# EasyEDA Pro project ProProject_迷你自平衡三棱柱2_2023-12-08.epro

# Schematic schematic1
Create Date: 2023-11-03; Page Name: P1; Project Name: 迷你自平衡三棱柱2; Schematic Name: schematic1; Update Date: 2023-11-15; Company: 嘉立创EDA; Page Size: A4; Version: V1.0
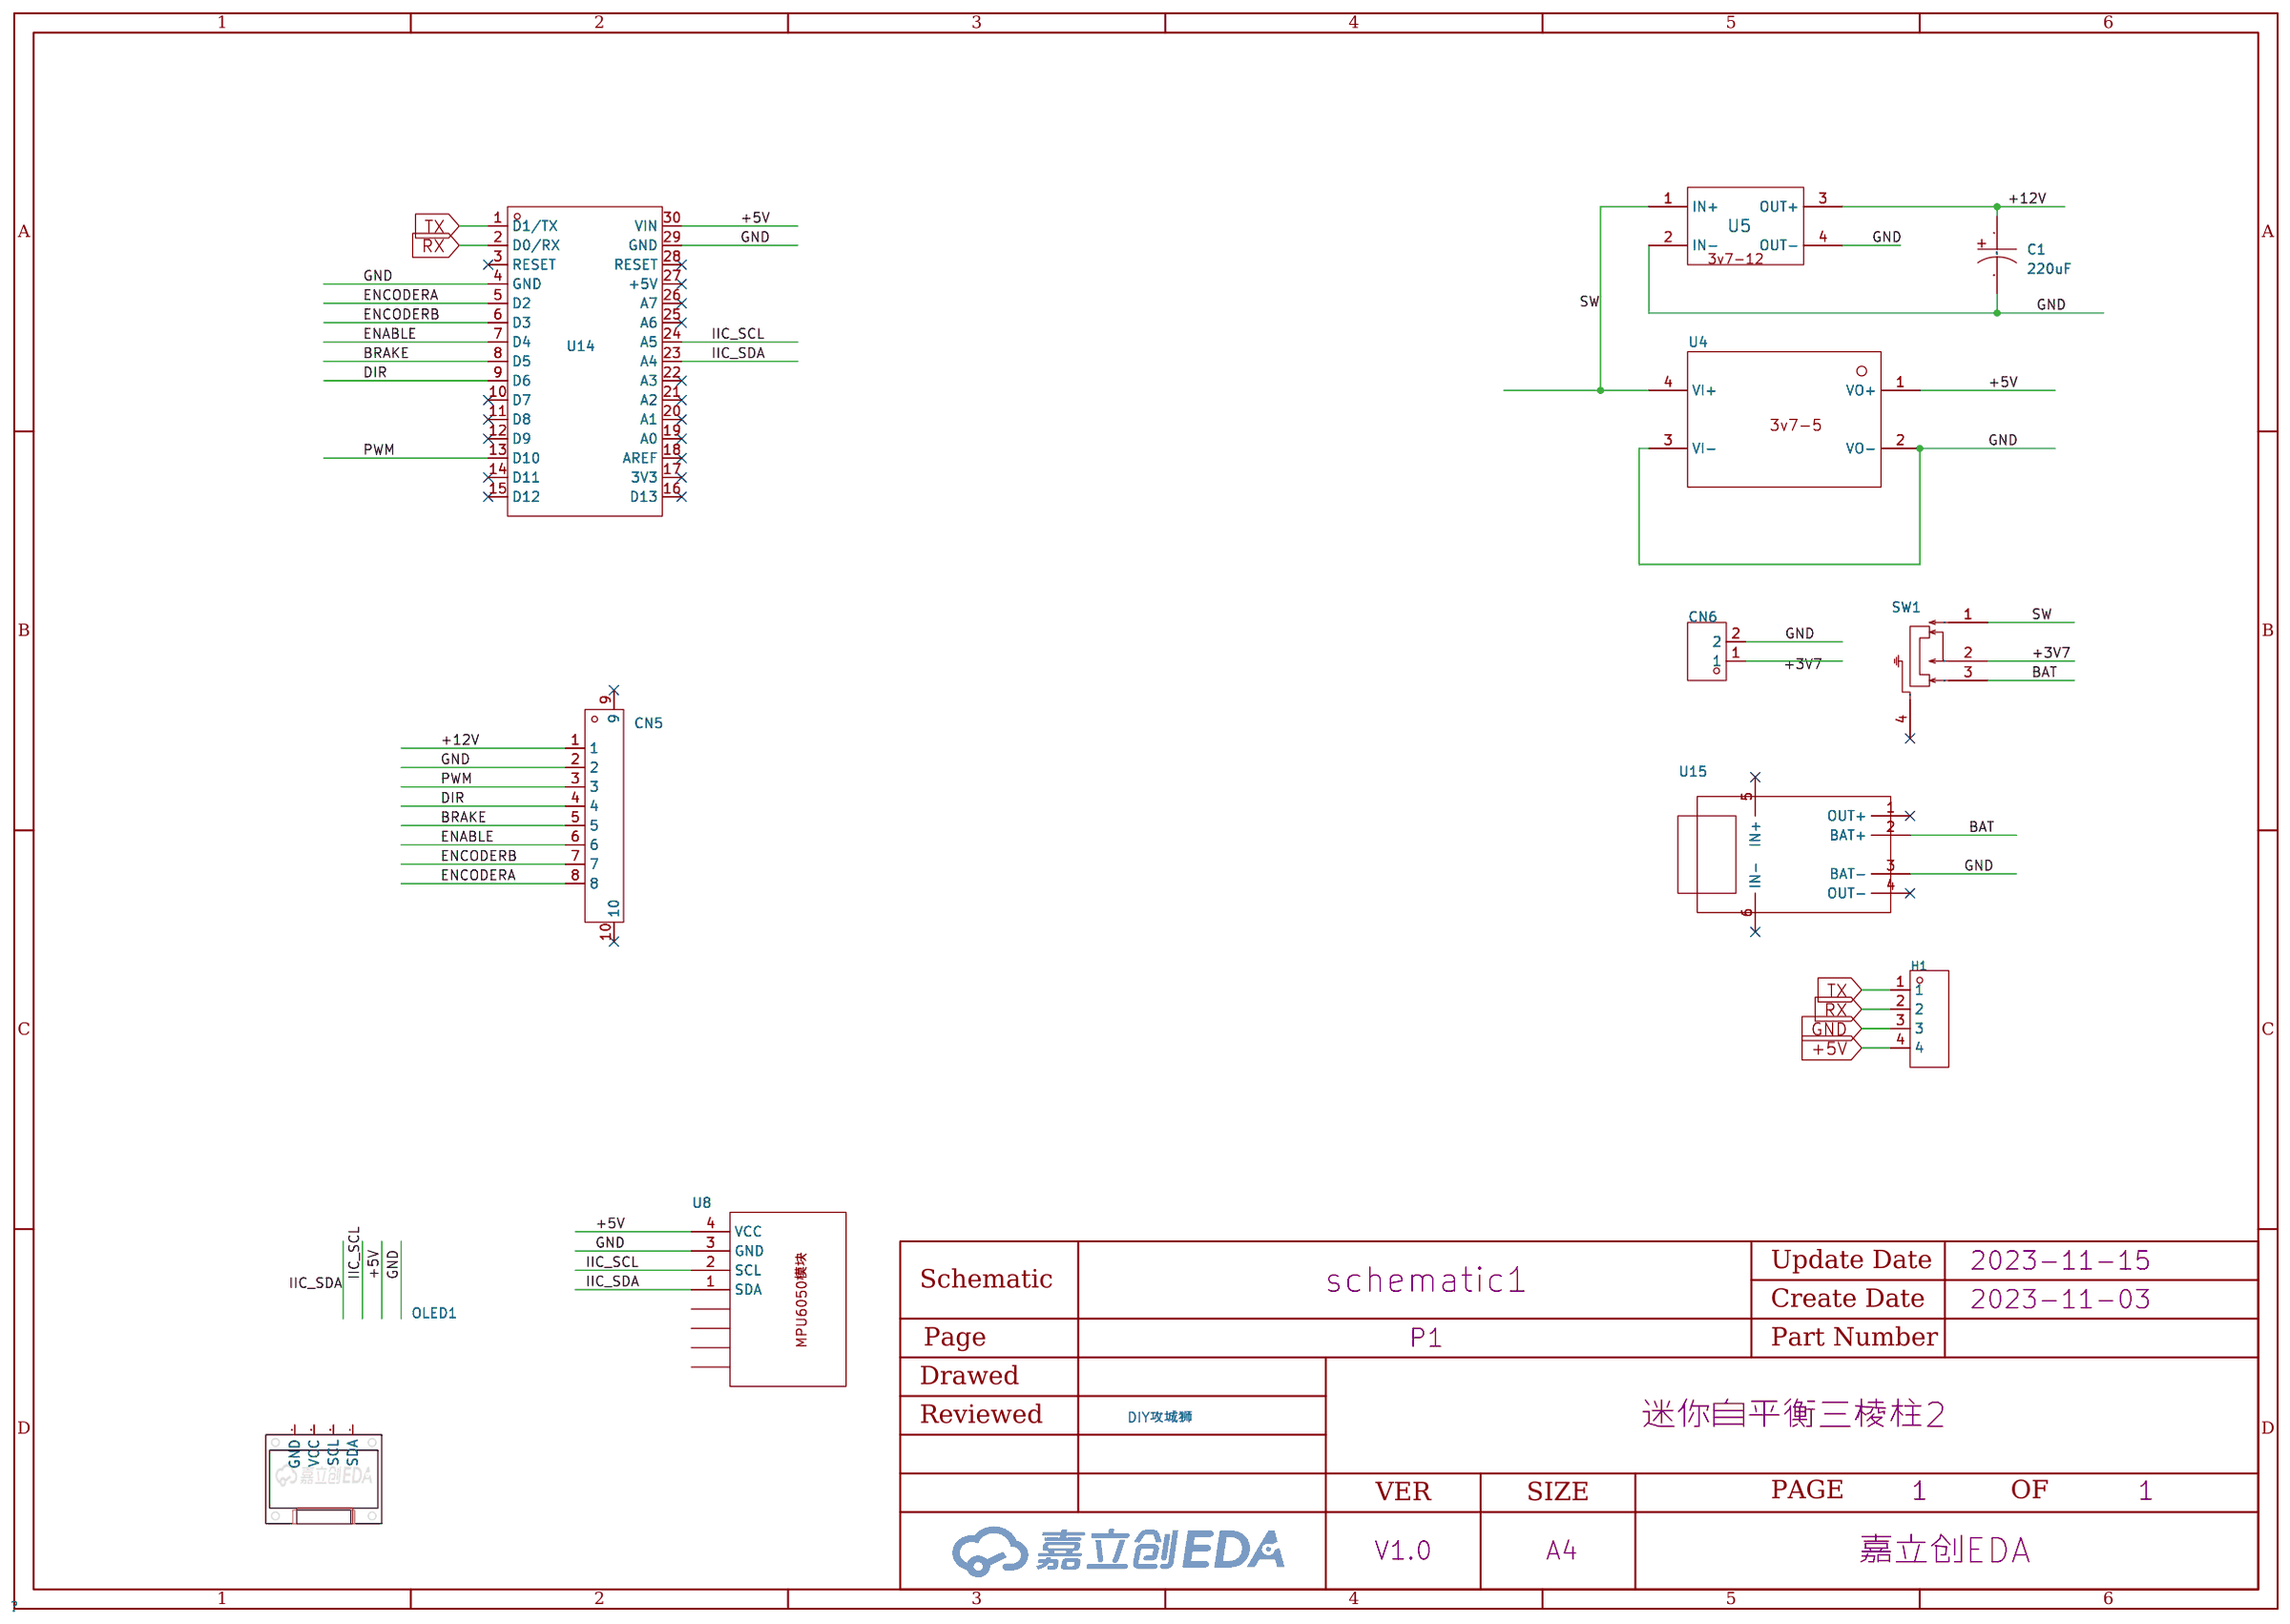
[diagram p0: schematic sheet]

## Parts
C1  220uF  [CAP-SMD_BD8.0-L8.3-W8.3-FD]
CN5  GH1.25-8PLTPZ  [CONN-SMD_GH1.25-8PLTPZ]
CN6  B2B-XH-A(LF)(SN)  [CONN-TH_B2B-XH-A-LF-SN]
H1  -  [HDR-TH_4P-P2.54-V-M]
OLED1  -  [0.96OLED_4P]
SW1  HX MSK12CO2-BBTM  [SW-SMD_MSK12C02-HB]
U4  DM13-05  [DM13-05]
U5  -  [DC3V7-DC12]
U8  -  [MPU-6050模块2]
U14  ARDUINO_NANO  [COMM-TH_ARDUINO_NANO2]
U15  -  [TP4057模块封装]

## Library data of the parts
C1 = EEEFP1V221AP: 容值:220uF;精度:±20%;额定电压:35V;电容体直径:8mm;电容体长度:10.2mm;纹波电流:-;等效串联电阻:-;工作寿命:2000hrs@105℃;工作温度:-45℃~+105℃;; LCSC Part Name: 220uF ±20% 35V; Supplier Part: C278406; Manufacturer: PANASONIC(松下); Supplier Footprint: SMD,8x10.2mm; JLCPCB Part Class: Extended Part; Datasheet: https://atta.szlcsc.com/upload/public/pdf/source/20181130/C278406_CB9CD87BC4579E70B6A89BF3334E5E7E.pdf; Supplier: LCSC; Tolerance: ±20%; Rated Voltage: 35V; φD: 8mm; L: 10.2mm; Lifetime @ Temp: 2000hrs@105℃; Operating Temperature: -45℃~+105℃
CN5 = GH1.25-8PLTPZ: LCSC Part Name: GH1.25-8P立贴编带加盖; Supplier Part: C2829266; Manufacturer: BOOMELE(博穆精密); JLCPCB Part Class: Extended Part; Datasheet: https://atta.szlcsc.com/upload/public/pdf/source/20211125/08A09A4909F58AF780B71FE423A00F7E.pdf; Supplier: LCSC
CN6 = B2B-XH-A(LF)(SN): 参考系列:XH;间距:2.5mm;插针结构:1x2P;排数:1;每排PIN数:2;行距:-;安装方式:-;触头材质:黄铜;; LCSC Part Name: XH 2.5mm 1x2P; Supplier Part: C158012; Manufacturer: JST; Supplier Footprint: 插件,P=2.5mm; JLCPCB Part Class: Extended Part; Datasheet: https://atta.szlcsc.comnull; Supplier: LCSC; Reference Series: XH; Pitch: 2.5mm; Pins Structure: 1x2P; Number of Rows: 1; Number of PINs Per Row: 2; Contact Material: 黄铜
H1 = HDR-M_2.54_1x4P: Supplier Part: C492403; Supplier Footprint: 插件
OLED1 = 0.96OLED模块_4P: Supplier Footprint: 插件
SW1 = HX MSK12CO2-BBTM: LCSC Part Name: 拨动开关 MSK12C02两档侧拨贴片 7脚拨动 白柄带膜,柄长1.5mm,耐温; Supplier Part: C5149818; Manufacturer: hanxia(韩下); Supplier Footprint: SMD; JLCPCB Part Class: 扩展库; Datasheet: https://atta.szlcsc.com/upload/public/pdf/source/20220909/02E3C8DB095F8D03A7BE1249731DCC0B.pdf; Supplier: LCSC
U4 = DM13-05: _: 3
U5 = DC3V7-DC12
U8 = MPU-6050模块
U14 = ARDUINO_NANO: Supplier Part: C9900017879; Supplier Footprint: 插件; JLCPCB Part Class: 扩展库; Datasheet: https://atta.szlcsc.comnull; Supplier: LCSC
U15 = TP4057模块

## Nets
+3V7: CN6.1 SW1.2
+5V: H1.4 U4.1(VO+) U8.4(VCC) U14.30(VIN)
+12V: C1.1 CN5.1 U5.3(OUT+)
GND: C1.2 CN5.2 CN6.2 H1.3 U4.2(VO-) U4.3(VI-) U5.2(IN-) U5.4(OUT-) U8.3(GND) U14.4(GND) U14.29(GND) U15.3(BAT-)
BAT: SW1.3 U15.2(BAT+)
BRAKE: CN5.5 U14.8(D5)
DIR: CN5.4 U14.9(D6)
ENABLE: CN5.6 U14.7(D4)
ENCODERA: CN5.8 U14.5(D2)
ENCODERB: CN5.7 U14.6(D3)
IIC_SCL: U8.2(SCL) U14.24(A5)
IIC_SDA: U8.1(SDA) U14.23(A4)
PWM: CN5.3 U14.13(D10)
RX: H1.2 U14.2(D0/RX)
SW: SW1.1 U4.4(VI+) U5.1(IN+)
TX: H1.1 U14.1(D1/TX)

Not connected (* = marked no-connect by the designer): CN5 9* 10*; OLED1 1(GND) 2(VCC) 3(SCL) 4(SDA); SW1 4*; U14 3(RESET)* 10(D7)* 11(D8)* 12(D9)* 14(D11)* 15(D12)* 16(D13)* 17(3V3)* 18(AREF)* 19(A0)* 20(A1)* 21(A2)* 22(A3)* 25(A6)* 26(A7)* 27(+5V)* 28(RESET)*; U15 1(OUT+)* 4(OUT-)* 5(IN+)* 6(IN-)*

## Notes on the sheet
- DIY攻城狮

# Board PCB1_1
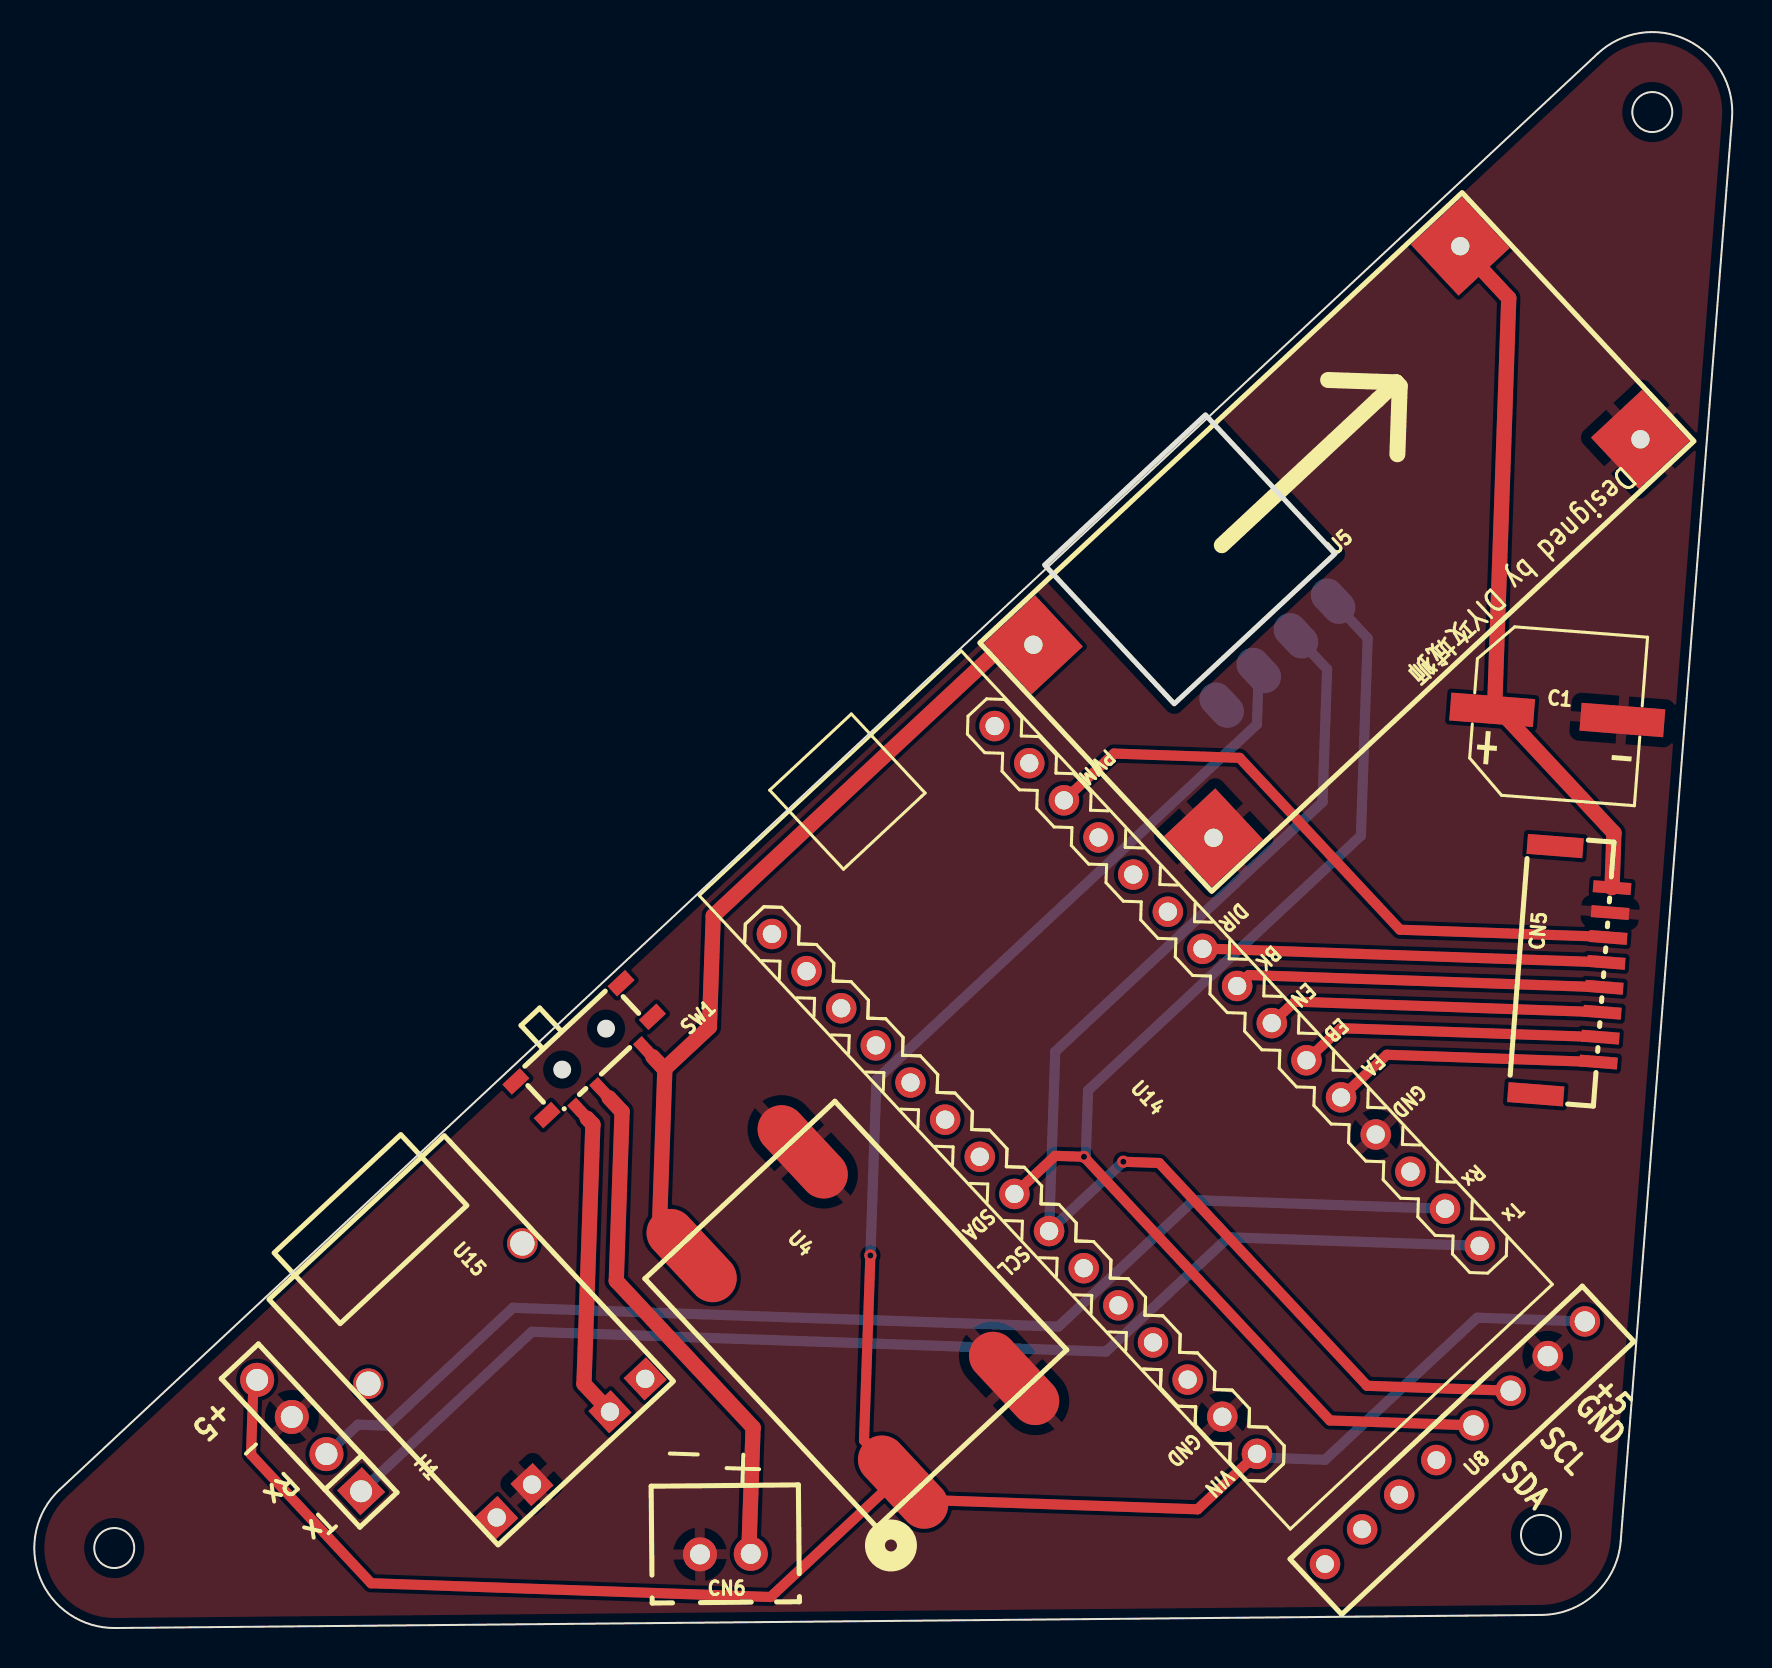
[diagram p1: board, top side]
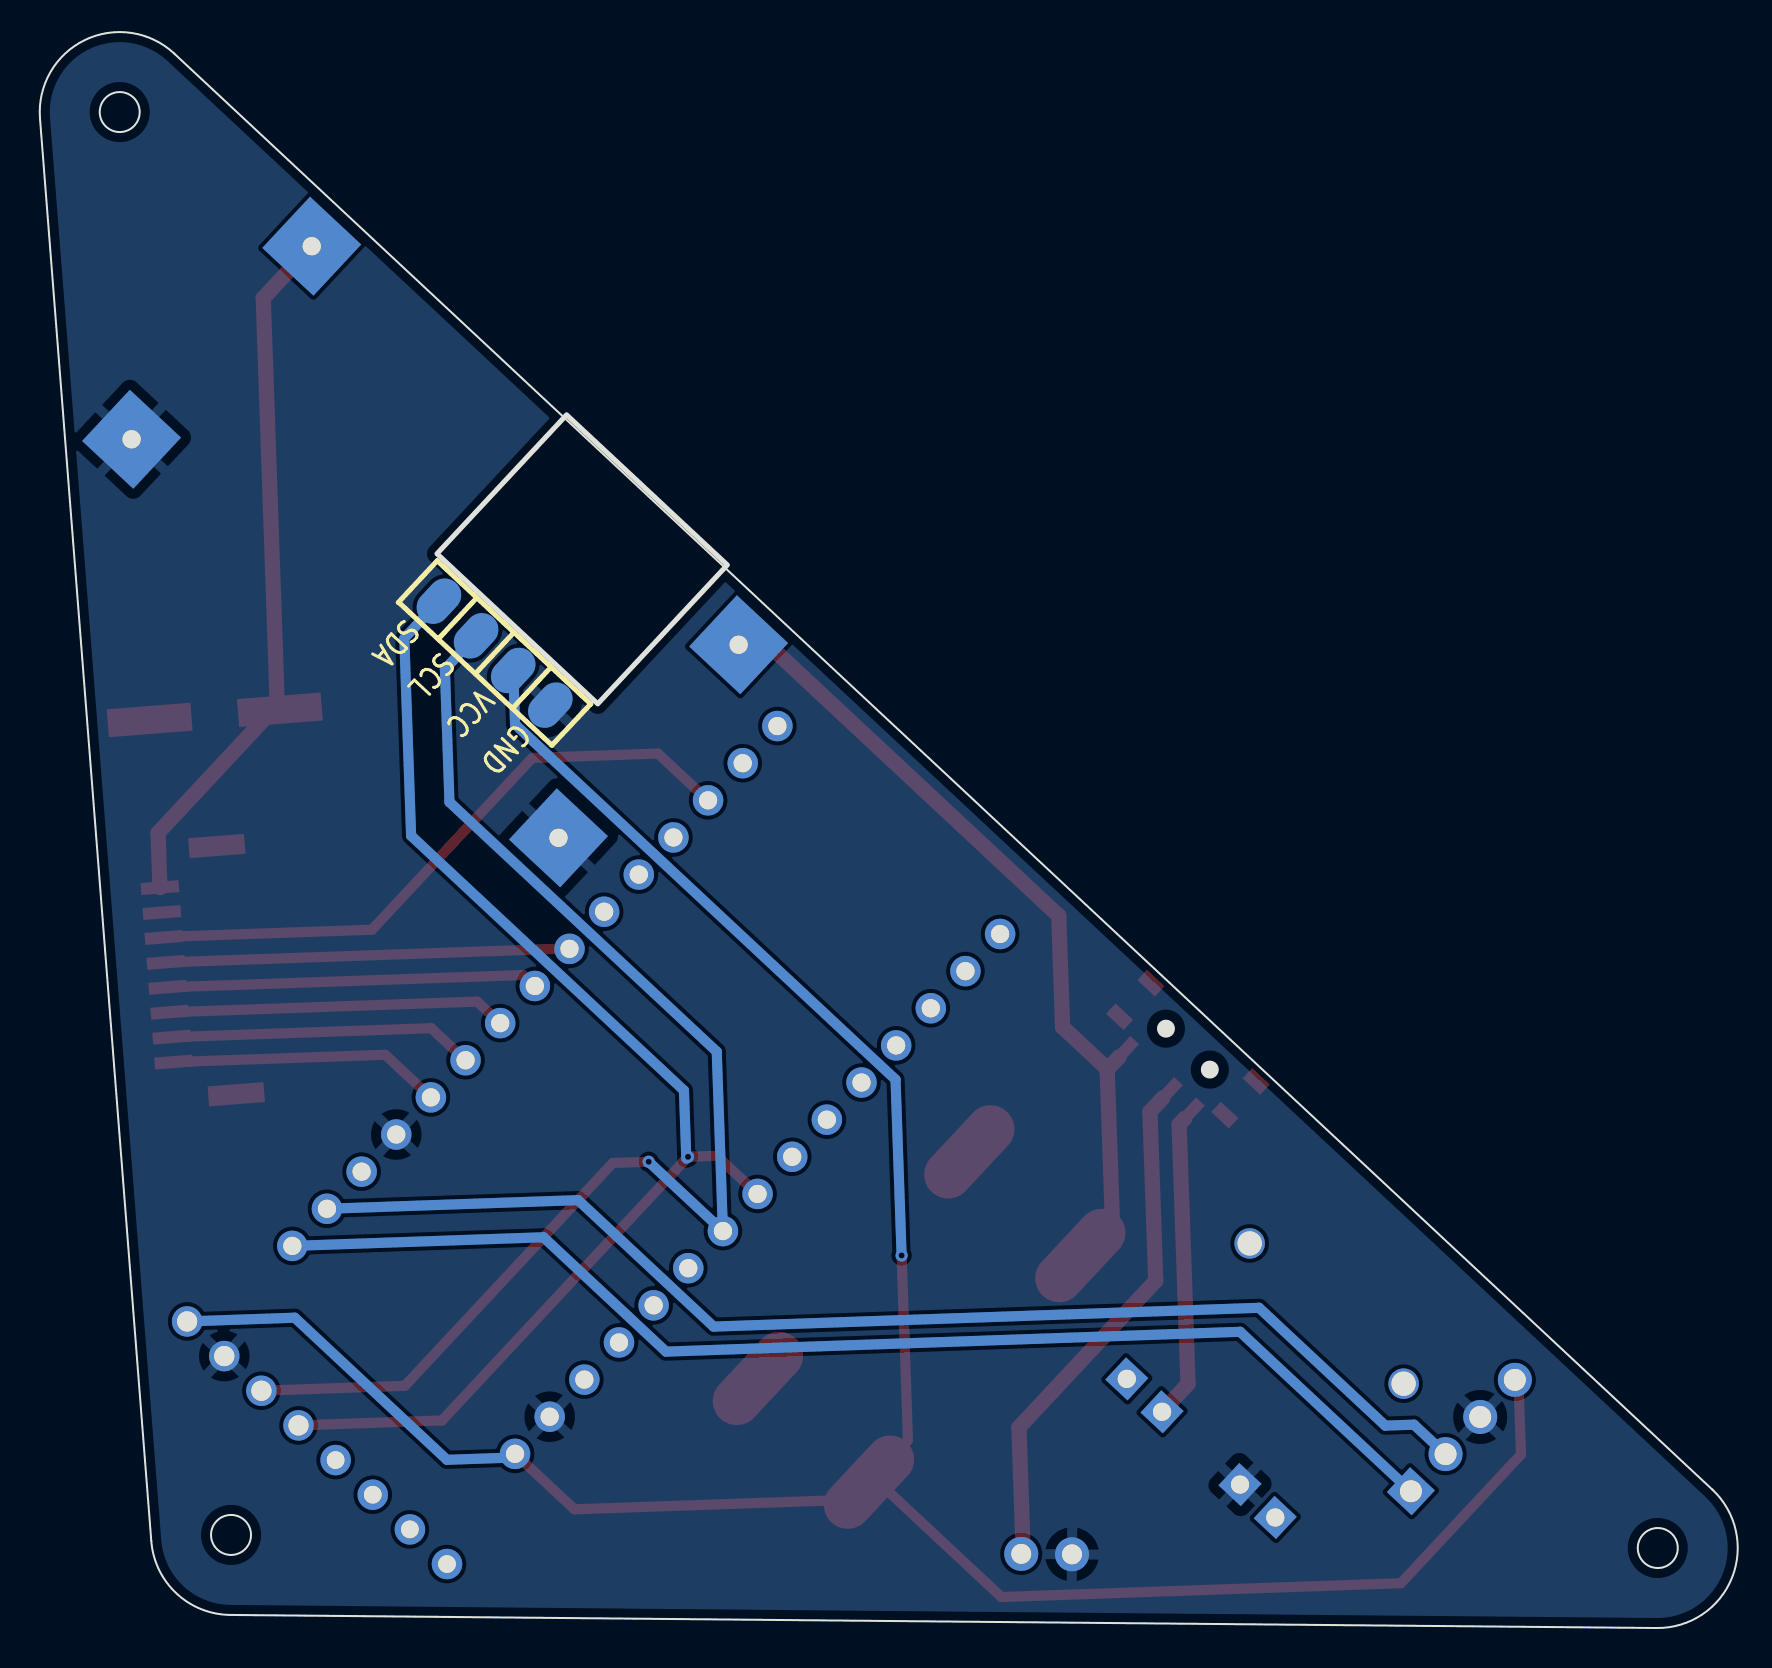
[diagram p2: board, bottom side, seen from below]

Outline 84.64 x 79.41 mm; copper layers: Top Layer, Bottom Layer. Coordinates in mm from the lower left corner of the outline.
Outline path: circle c3.71,4 r1 ; 64.78,53.72 56.74,46.22 50.26,53.16 58.3,60.67 closed ; circle c75.08,4.65 r1 ; circle c80.65,75.81 r1 ; 0.99,6.92 77.92,78.73 arc(82.39,79.41) 84.64,75.5 79.07,4.34 arc(77.81,1.73) 75.12,0.65 3.75,0 arc(0,2.52) 0.99,6.92
Stack: Top Layer 0.035mm / Dielectric1 1.51mm FR4 er 4.5 / Bottom Layer 0.035mm

## Design rules (mm)
template: 自定义配置
spacing copperThickness1oz (default): track to track 0.102, other pairs 0.152 to 0.3
spacing copperThickness2oz: track to track 0.203, other pairs 0.152 to 0.3
track width copperThickness1oz (default): min 0.127, default 0.254, max 2.54
track width copperThickness2oz: min 0.203, default 0.254, max 2.54
differential pair differentialPair (default): width min 0.127, default 0.254, max 2.54; gap min 0.152, default 0.152
via viaSize (default): diameter min 0.5, default 0.61, max 10; hole min 0.3, default 0.305, max 6.3

## Placement (name value [footprint] x y rotation side)
C1  220uF  [CAP-SMD_BD8.0-L8.3-W8.3-FD]  75.9 45.66 355.5 top
CN5  GH1.25-8PLTPZ  [CONN-SMD_GH1.25-8PLTPZ]  76.8 32.78 265.5 top
CN6  B2B-XH-A(LF)(SN)  [CONN-TH_B2B-XH-A-LF-SN]  34.29 3.7 0.5 top
H1  -  [HDR-TH_4P-P2.54-V-M]  13.46 9.62 133 top
OLED1  -  [0.96oled_4p]  61.9 48.75 223 bottom
SW1  HX MSK12CO2-BBTM  [SW-SMD_MSK12C02-HB]  27.59 28.55 223 top
U4  -  [DM13-05]  40.81 15.69 133 top
U5  -  [dc3v7-dc12]  64.87 54.31 43 top
U8  -  [MPU-6050模块2]  70.69 9.36 43 top
U14  ARDUINO_NANO  [comm-th_arduino_nano2]  54.31 26.91 313 top
U15  -  [TP4057模块封装]  21.53 14.38 313 top

## Footprints (pads in the part's own frame, mm; a bottom-side part is the same pattern mirrored in y, then rotated)
0.96oled_4p
  oval 1.65x2.5 smd: 1(-3.81,-0.002) 2(-1.27,0.002) 3(1.27,0.002) 4(3.81,0.002)
CAP-SMD_BD8.0-L8.3-W8.3-FD
  rect 4.2x1.4 smd: 1(-3.267,0) 2(3.267,0)
comm-th_arduino_nano2
  round 1.524 hole 0.914: 1(17.78,7.62) 2(15.24,7.62) 3(12.7,7.62) 4(10.16,7.62) 5(7.62,7.62) 6(5.08,7.62) 7(2.54,7.62) 8(0,7.62) 9(-2.54,7.62) 10(-5.08,7.62) 11(-7.62,7.62) 12(-10.16,7.62) 13(-12.7,7.62) 14(-15.24,7.62) 15(-17.78,7.62) 16(-17.78,-7.62) 17(-15.24,-7.62) 18(-12.7,-7.62) 19(-10.16,-7.62) 20(-7.62,-7.62) 21(-5.08,-7.62) 22(-2.54,-7.62) 23(0,-7.62) 24(2.54,-7.62) 25(5.08,-7.62) 26(7.62,-7.62) 27(10.16,-7.62) 28(12.7,-7.62) 29(15.24,-7.62) 30(17.78,-7.62)
CONN-SMD_GH1.25-8PLTPZ
  rect 0.6x1.9 smd: 1(-4.375,1.5) 2(-3.125,1.5) 3(-1.875,1.5) 4(-0.625,1.5) 5(0.625,1.5) 6(1.875,1.5) 7(3.125,1.5) 8(4.375,1.5)
  rect 1x2.8 smd: 9(6.225,-1.5) 10(-6.225,-1.5)
CONN-TH_B2B-XH-A-LF-SN
  round 1.7 hole 1: 1(1.27,0) 2(-1.27,0)
dc3v7-dc12
  rect 3.5x3.5 hole 0.914: 1(-14.605,6.604) 2(-14.605,-6.604) 3(14.605,6.604) 4(14.605,-6.604)
DM13-05
  oval 5.499x2.401 smd: 1(-7.75,4) 2(-7.75,-3.599) 3(7.75,-3.599) 4(7.75,4)
HDR-TH_4P-P2.54-V-M
  rect 1.7x1.7 hole 1.1: 1(-3.81,0)
  round 1.7 hole 1.1: 2(-1.27,0) 3(1.27,0) 4(3.81,0)
MPU-6050模块2
  round 1.524 hole 1.016x0.889: 1(1.27,-0.127) 2(3.81,-0.127) 3(6.35,-0.127) 4(8.89,-0.127)
  round 1.524 hole 0.889: 5(-8.89,-0.127) 6(-6.35,-0.127) 7(-3.81,-0.127) 8(-1.27,-0.127)
SW-SMD_MSK12C02-HB
  rect 0.6x1.524 smd: 1(-2.25,1.7) 2(0.75,1.7) 3(2.25,1.7)
  rect 1.2x0.7 smd: 4(-3.6,-1.7) 4(-3.6,0.6) 4(3.6,0.6) 4(3.6,-1.7)
TP4057模块封装
  rect 1.524x1.524 hole 0.914: 1(7.366,5.08) 2(7.366,2.667) 3(7.366,-2.667) 4(7.366,-5.08)
  round 1.524 hole 1.219: 5(-1.778,5.207) 6(-1.905,-5.207)

## Nets
+3V7: CN6.1 SW1.2
+5V: H1.4 OLED1.3 U4.1 U8.4 U14.30
+12V: C1.1 CN5.1 U5.3
GND: C1.2 CN5.2 CN6.2 H1.3 OLED1.4 U4.2 U4.3 U5.2 U5.4 U8.3 U14.4 U14.29 U15.3
BAT: SW1.3 U15.2
BRAKE: CN5.5 U14.8
DIR: CN5.4 U14.9
ENABLE: CN5.6 U14.7
ENCODERA: CN5.8 U14.5
ENCODERB: CN5.7 U14.6
IIC_SCL: OLED1.2 U8.2 U14.24
IIC_SDA: OLED1.1 U8.1 U14.23
PWM: CN5.3 U14.13
RX: H1.2 U14.2
SW: SW1.1 U4.4 U5.1
TX: H1.1 U14.1

Pads without a net: CN5 9 10; SW1 4; U8 5 6 7 8; U14 3 10 11 12 14 15 16 17 18 19 20 21 22 25 26 27 28; U15 1 4 5 6

## Via types
v1: diameter 0.61, hole 0.305, Top Layer to Bottom Layer, 3 vias

## Routing (per net, layer and track width the routed paths; a pad name or vN(x,y) marks a point on that pad's centre or on a via; arc(x,y) is an arc through that point)
+3V7: length 25.8
  Top Layer w0.762: 28.47,26.51 29.12,25.81 28.83,17.36 35.67,10.03 35.46,3.81 CN6.1
+5V: length 129
  Top Layer w0.508: 10.7,12.78 10.56,8.68 16.56,2.24 36.55,1.55 42.86,7.44 ; U14.30 57.9,5.94 43.99,6.42 U4.1 41.22,9.39 v1(41.54,18.63)
  Bottom Layer w0.508: 77.28,15.33 71.89,15.52 64.28,8.41 61.42,8.51 ; OLED1.3 60.87,45.19 41.84,27.43 v1(41.54,18.63)
+12V: length 35.4
  Top Layer w0.762: U5.3 73.47,66.5 72.77,46.15 78.73,39.76 CN5.1
BAT: length 15.3
  Top Layer w0.762: U15.2 27.21,12.21 27.66,25.18 27.37,25.49
BRAKE: length 18.6
  Top Layer w0.508: CN5.5 60.47,32.65 59.89,32.11
DIR: length 20.3
  Top Layer w0.508: 58.12,33.93 58.17,33.98 CN5.4
ENABLE: length 17
  Top Layer w0.508: 61.62,30.25 62.77,31.32 78.15,30.79
ENCODERA: length 13.7
  Top Layer w0.508: U14.5 67.37,28.67 CN5.8
ENCODERB: length 15.3
  Top Layer w0.508: 78.05,29.55 65.07,30 U14.6
IIC_SCL: length 65.5
  Top Layer w0.508: U8.2 66.38,12.11 55.99,23.25 v1(54.19,23.32)
  Bottom Layer w0.508: OLED1.2 64.39,47.94 64.16,41.3 50.79,28.82 U14.24 v1(54.19,23.32)
IIC_SDA: length 63.9
  Top Layer w0.508: U14.23 50.79,23.61 v1(52.22,23.56) 64.53,10.38 U8.1
  Bottom Layer w0.508: 52.31,23.47 52.43,26.88 66.08,39.62 66.42,49.49 OLED1.1
PWM: length 31.9
  Top Layer w0.508: U14.13 53.73,43.73 60.01,43.51 68.03,34.92 78.42,34.56 CN5.3
RX: length 61.4
  Bottom Layer w0.508: U14.2 57.72,21.4 50.94,15.07 23.66,16.01 17.34,10.12 15.91,10.17 H1.2
SW: length 40.8
  Top Layer w0.762: 30.66,28.56 31.26,27.92 31,20.34 32.6,18.63 ; 31.29,28 33.49,30.05 33.68,35.61 48.26,49.22 U5.1
TX: length 61.4
  Bottom Layer w0.508: U14.1 59.45,19.54 53.32,13.82 24.6,14.81 H1.1

## Copper pours and planes (outline as drawn; the poured copper is in the pictures)
GND on Top Layer: 131.85,39.69 34.92,-50.78 -15.94,3.72 80.99,94.19
GND on Bottom Layer: 121.53,39.95 37.32,-38.64 -3.58,5.18 80.63,83.78

## Text on the board
Bottom Silkscreen Layer: GND | VCC | SCL | SDA
Top Silkscreen Layer: PWM | DIR | BK | EN | EB | EA | SDA | SCL | GND | VIN | Rx | Tx | +5 | - | + | Designed by DIY攻城狮

# Board PCB1
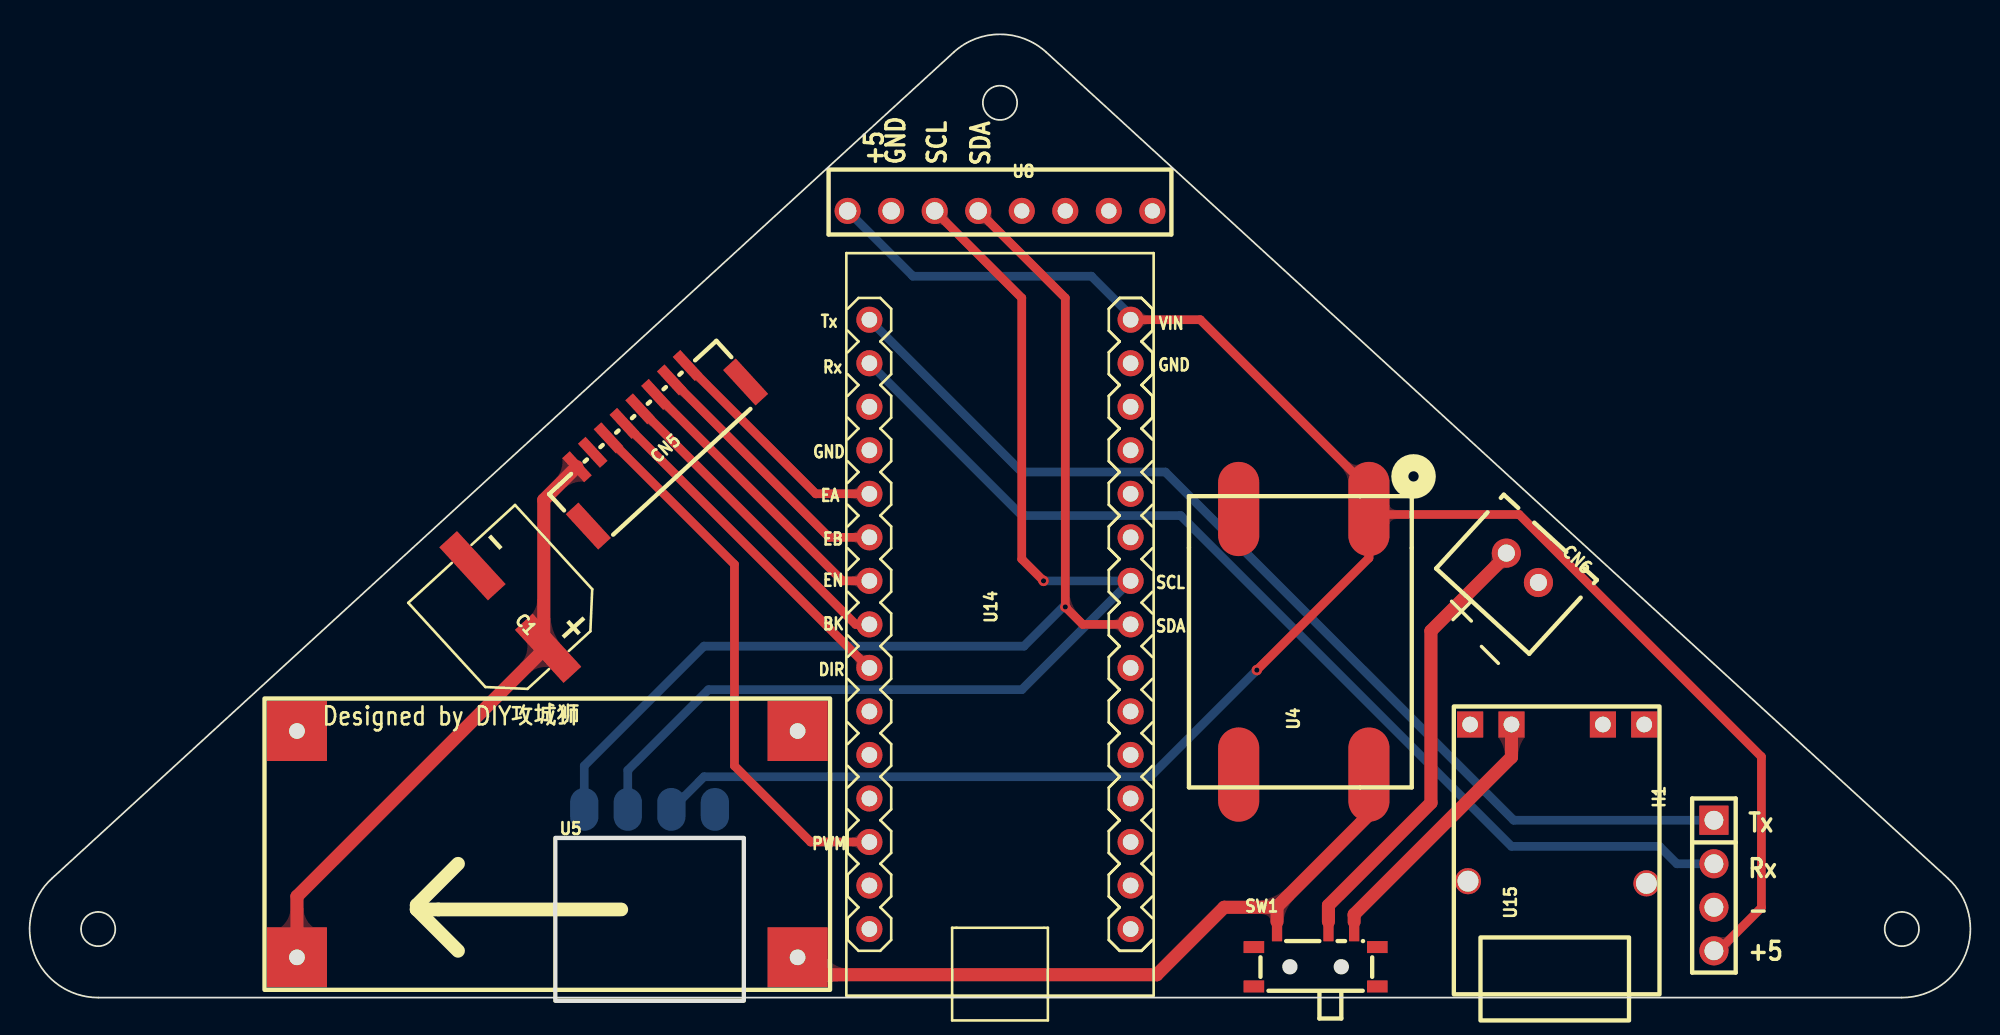
[diagram p3: board, top side]
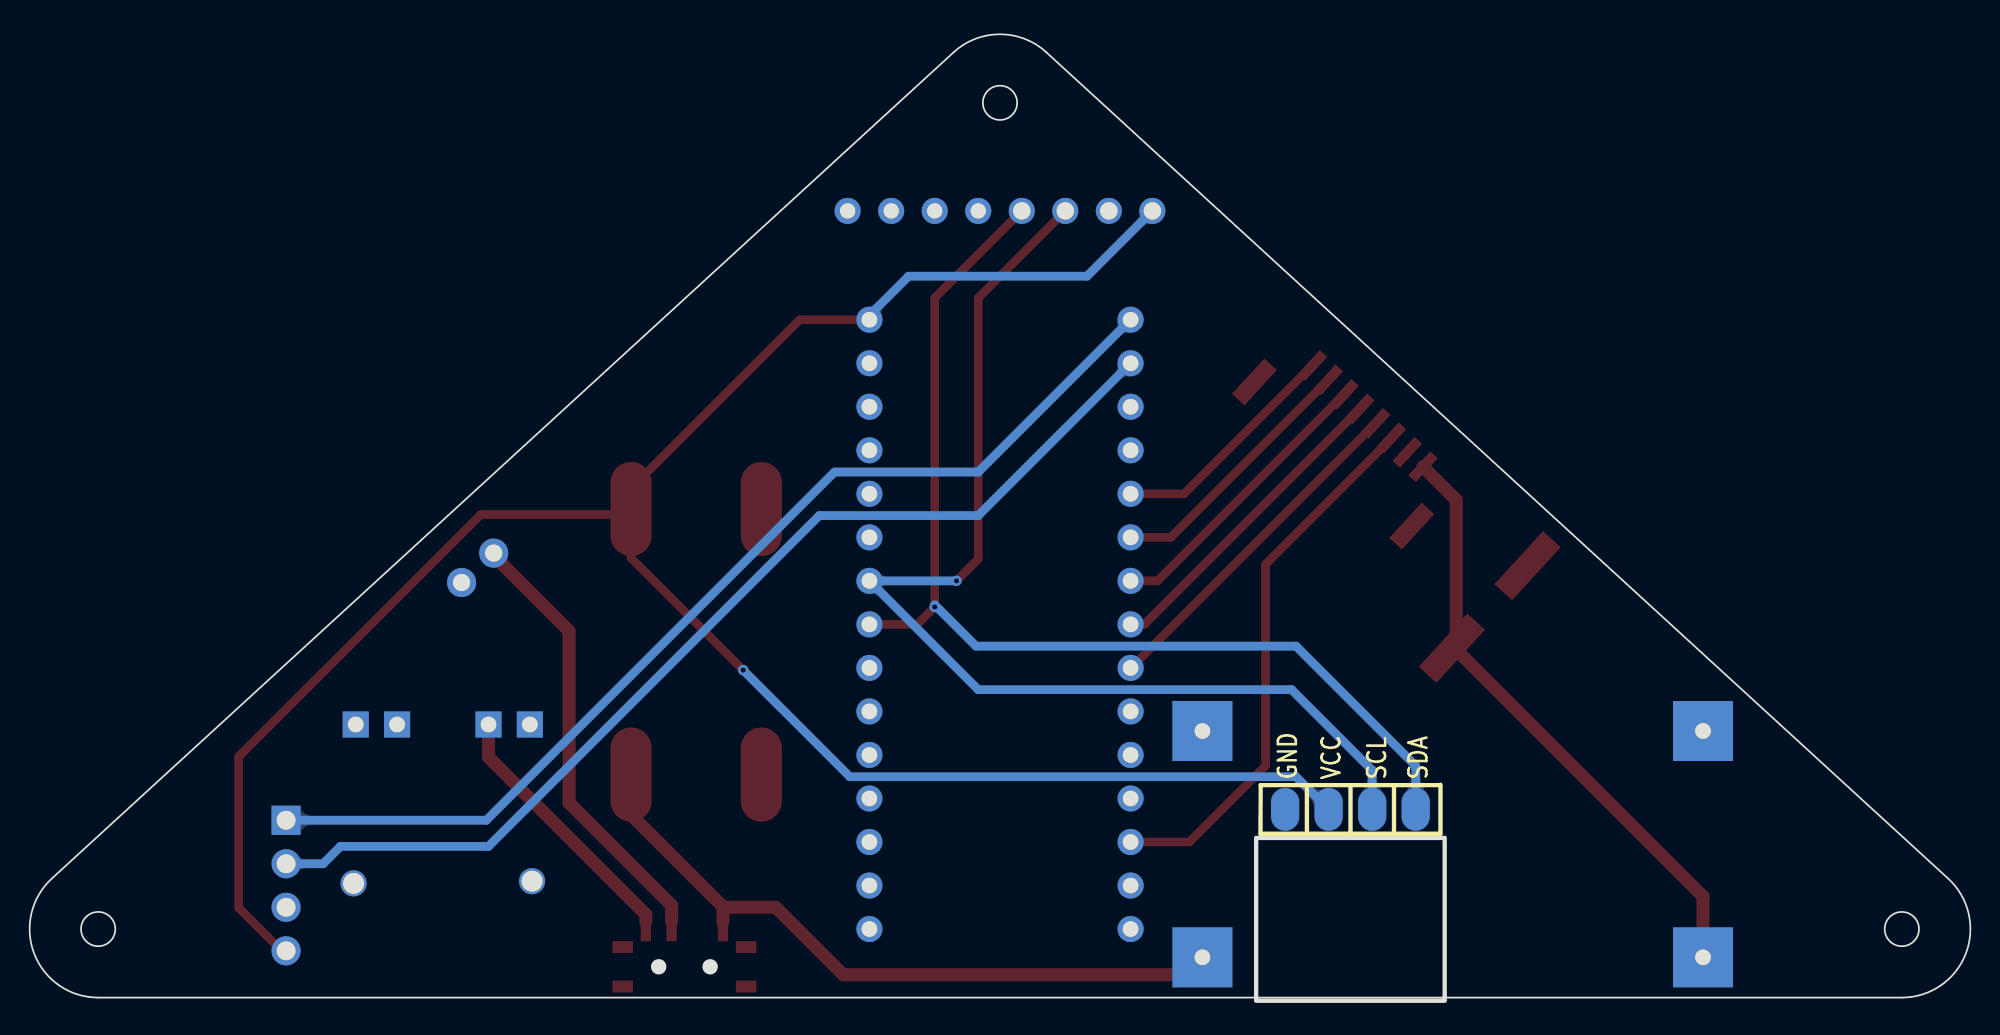
[diagram p4: board, bottom side, seen from below]

Outline 112.7 x 56.4 mm; copper layers: Top Layer, Bottom Layer. Coordinates in mm from the lower left corner of the outline.
Outline path: circle c3.73,4.18 r1 ; rectangle 30.4,9.5 41.4,0 ; circle c56.35,52.4 r1 ; circle c108.97,4.18 r1 ; 1.03,7.13 53.65,55.35 arc(56.35,56.4) 59.05,55.35 111.67,7.13 arc(112.7,2.73) 108.97,0.18 3.73,0.18 arc(0,2.73) 1.03,7.13
Stack: Top Layer 0.035mm / Dielectric1 1.51mm FR4 er 4.5 / Bottom Layer 0.035mm

## Design rules (mm)
template: 自定义配置
spacing copperThickness1oz (default): track to track 0.102, other pairs 0.152 to 0.3
spacing copperThickness2oz: track to track 0.203, other pairs 0.152 to 0.3
track width copperThickness1oz (default): min 0.127, default 0.254, max 2.54
track width copperThickness2oz: min 0.203, default 0.254, max 2.54
differential pair differentialPair (default): width min 0.127, default 0.254, max 2.54; gap min 0.152, default 0.152
via viaSize (default): diameter min 0.5, default 0.61, max 10; hole min 0.3, default 0.305, max 6.3

## Placement (name value [footprint] x y rotation side)
C1  220uF  [CAP-SMD_BD8.0-L8.3-W8.3-FD]  27.77 22.98 132.5 top
CN5  GH1.25-8PLTPZ  [CONN-SMD_GH1.25-8PLTPZ]  35.9 33.01 42.5 top
CN6  B2B-XH-A(LF)(SN)  [CONN-TH_B2B-XH-A-LF-SN]  86.83 25.27 137.5 top
H1  -  [HDR-TH_4P-P2.54-V-M]  98 6.72 270 top
OLED1  -  [0.96OLED_4P]  35.9 11.17 0 bottom
SW1  HX MSK12CO2-BBTM  [SW-SMD_MSK12C02-HB]  74.76 2.53 0 top
U4  -  [DM13-05]  73.87 20.95 270 top
U5  -  [DC3V7-DC12]  29.93 9.14 180 top
U8  -  [MPU-6050模块2]  56.35 45.97 180 top
U14  ARDUINO_NANO  [COMM-TH_ARDUINO_NANO2]  56.35 21.96 90 top
U15  -  [TP4057模块封装]  88.86 8.76 90 top

## Footprints (pads in the part's own frame, mm; a bottom-side part is the same pattern mirrored in y, then rotated)
0.96OLED_4P
  oval 1.65x2.5 smd: 1(-3.81,-0.002) 2(-1.27,0.002) 3(1.27,0.002) 4(3.81,0.002)
CAP-SMD_BD8.0-L8.3-W8.3-FD
  rect 4.2x1.4 smd: 1(-3.267,0) 2(3.267,0)
COMM-TH_ARDUINO_NANO2
  round 1.524 hole 0.914: 1(17.78,7.62) 2(15.24,7.62) 3(12.7,7.62) 4(10.16,7.62) 5(7.62,7.62) 6(5.08,7.62) 7(2.54,7.62) 8(0,7.62) 9(-2.54,7.62) 10(-5.08,7.62) 11(-7.62,7.62) 12(-10.16,7.62) 13(-12.7,7.62) 14(-15.24,7.62) 15(-17.78,7.62) 16(-17.78,-7.62) 17(-15.24,-7.62) 18(-12.7,-7.62) 19(-10.16,-7.62) 20(-7.62,-7.62) 21(-5.08,-7.62) 22(-2.54,-7.62) 23(0,-7.62) 24(2.54,-7.62) 25(5.08,-7.62) 26(7.62,-7.62) 27(10.16,-7.62) 28(12.7,-7.62) 29(15.24,-7.62) 30(17.78,-7.62)
CONN-SMD_GH1.25-8PLTPZ
  rect 0.6x1.9 smd: 1(-4.375,1.5) 2(-3.125,1.5) 3(-1.875,1.5) 4(-0.625,1.5) 5(0.625,1.5) 6(1.875,1.5) 7(3.125,1.5) 8(4.375,1.5)
  rect 1x2.8 smd: 9(6.225,-1.5) 10(-6.225,-1.5)
CONN-TH_B2B-XH-A-LF-SN
  round 1.7 hole 1: 1(1.27,0) 2(-1.27,0)
DC3V7-DC12
  rect 3.5x3.5 hole 0.914: 1(-14.605,6.604) 2(-14.605,-6.604) 3(14.605,6.604) 4(14.605,-6.604)
DM13-05
  oval 5.499x2.401 smd: 1(-7.75,4) 2(-7.75,-3.599) 3(7.75,-3.599) 4(7.75,4)
HDR-TH_4P-P2.54-V-M
  rect 1.7x1.7 hole 1.1: 1(-3.81,0)
  round 1.7 hole 1.1: 2(-1.27,0) 3(1.27,0) 4(3.81,0)
MPU-6050模块2
  round 1.524 hole 1.016x0.889: 1(1.27,-0.127) 2(3.81,-0.127) 3(6.35,-0.127) 4(8.89,-0.127)
  round 1.524 hole 0.889: 5(-8.89,-0.127) 6(-6.35,-0.127) 7(-3.81,-0.127) 8(-1.27,-0.127)
SW-SMD_MSK12C02-HB
  rect 0.6x1.524 smd: 1(-2.25,1.7) 2(0.75,1.7) 3(2.25,1.7)
  rect 1.2x0.7 smd: 4(-3.6,0.6) 4(-3.6,-1.7) 4(3.6,0.6) 4(3.6,-1.7)
TP4057模块封装
  rect 1.524x1.524 hole 0.914: 1(7.366,5.08) 2(7.366,2.667) 3(7.366,-2.667) 4(7.366,-5.08)
  round 1.524 hole 1.219: 5(-1.778,5.207) 6(-1.905,-5.207)

## Nets
+3V7: CN6.1 SW1.2
+5V: H1.4 OLED1.3 U4.1 U8.4 U14.30
+12V: C1.1 CN5.1 U5.3
GND: C1.2 CN5.2 CN6.2 H1.3 OLED1.4 U4.2 U4.3 U5.2 U5.4 U8.3 U14.4 U14.29 U15.3
BAT: SW1.3 U15.2
BRAKE: CN5.5 U14.8
DIR: CN5.4 U14.9
ENABLE: CN5.6 U14.7
ENCODERA: CN5.8 U14.5
ENCODERB: CN5.7 U14.6
IIC_SCL: OLED1.2 U8.2 U14.24
IIC_SDA: OLED1.1 U8.1 U14.23
PWM: CN5.3 U14.13
RX: H1.2 U14.2
SW: SW1.1 U4.4 U5.1
TX: H1.1 U14.1

Pads without a net: CN5 9 10; SW1 4; U8 5 6 7 8; U14 3 10 11 12 14 15 16 17 18 19 20 21 22 25 26 27 28; U15 1 4 5 6

## Via types
v1: diameter 0.61, hole 0.305, Top Layer to Bottom Layer, 3 vias

## Routing (per net, layer and track width the routed paths; a pad name or vN(x,y) marks a point on that pad's centre or on a via; arc(x,y) is an arc through that point)
+3V7: length 25.8
  Top Layer w0.762: 75.51,4.61 75.51,5.57 81.49,11.55 81.49,21.58 85.89,25.98 CN6.1
+5V: length 129
  Top Layer w0.508: U14.30 68.03,39.74 77.88,29.9 U4.1 77.88,25.84 v1(71.33,19.3) ; 78,28.38 86.64,28.38 100.78,14.24 100.78,5.43 97.88,2.53
  Bottom Layer w0.508: U8.4 51.27,42.28 61.68,42.28 63.7,40.26 ; v1(71.33,19.3) 65.11,13.07 39.08,13.07 OLED1.3
+12V: length 35.4
  Top Layer w0.762: U5.3 15.33,6.09 29.73,20.49 29.73,29.23 CN5.1
BAT: length 15.3
  Top Layer w0.762: U15.2 86.19,14.22 77.01,5.04 77.01,4.61
BRAKE: length 18.6
  Top Layer w0.508: U14.8 47.93,21.96 CN5.5
DIR: length 20.3
  Top Layer w0.508: 48.78,19.42 48.7,19.42 34.43,33.7
ENABLE: length 17
  Top Layer w0.508: 36.27,35.39 47.15,24.5 U14.7
ENCODERA: length 13.7
  Top Layer w0.508: 38.11,37.07 45.6,29.58 U14.5
ENCODERB: length 15.3
  Top Layer w0.508: U14.6 46.38,27.04 CN5.7
IIC_SCL: length 65.5
  Top Layer w0.508: v1(58.89,24.5) 57.62,25.77 57.62,41.01 U8.2
  Bottom Layer w0.508: OLED1.2 34.63,13.45 39.33,18.15 57.62,18.15 U14.24 v1(58.89,24.5)
IIC_SDA: length 63.9
  Top Layer w0.508: U14.23 61.17,21.96 v1(60.16,22.98) 60.16,41.01 U8.1
  Bottom Layer w0.508: OLED1.1 32.09,13.71 39.08,20.69 57.75,20.69 60.16,23.11
PWM: length 31.9
  Top Layer w0.508: U14.13 45.3,9.26 40.85,13.71 40.85,25.46 33.51,32.81 33.51,32.85
RX: length 61.4
  Bottom Layer w0.508: H1.2 95.85,7.99 94.83,9.01 86.19,9.01 66.89,28.31 57.62,28.31 U14.2
SW: length 40.8
  Top Layer w0.762: 72.44,5.45 69.43,5.45 65.49,1.52 45.55,1.52 U5.1 ; U4.4 77.88,10.85 72.51,5.49 72.51,4.61
TX: length 61.4
  Bottom Layer w0.508: U14.1 57.62,30.85 66,30.85 86.32,10.53 H1.1

## Copper pours and planes (outline as drawn; the poured copper is in the pictures)
GND on Top Layer: -9.06,65.52 123.53,65.52 123.53,-9.02 -9.06,-9.02
GND on Bottom Layer: -1.69,58.29 113.5,58.29 113.5,-1.66 -1.69,-1.66

Small or netless copper shapes (teardrops, artwork), in the pictures only: 29 on Top Layer, 11 on Bottom Layer

## Text on the board
Bottom Silkscreen Layer: SDA | SCL | VCC | GND
Top Silkscreen Layer: PWM | DIR | EA | EB | EN | BK | GND | Tx | Rx | SCL | SDA | VIN | - | +5 | + | Designed by DIY攻城狮
